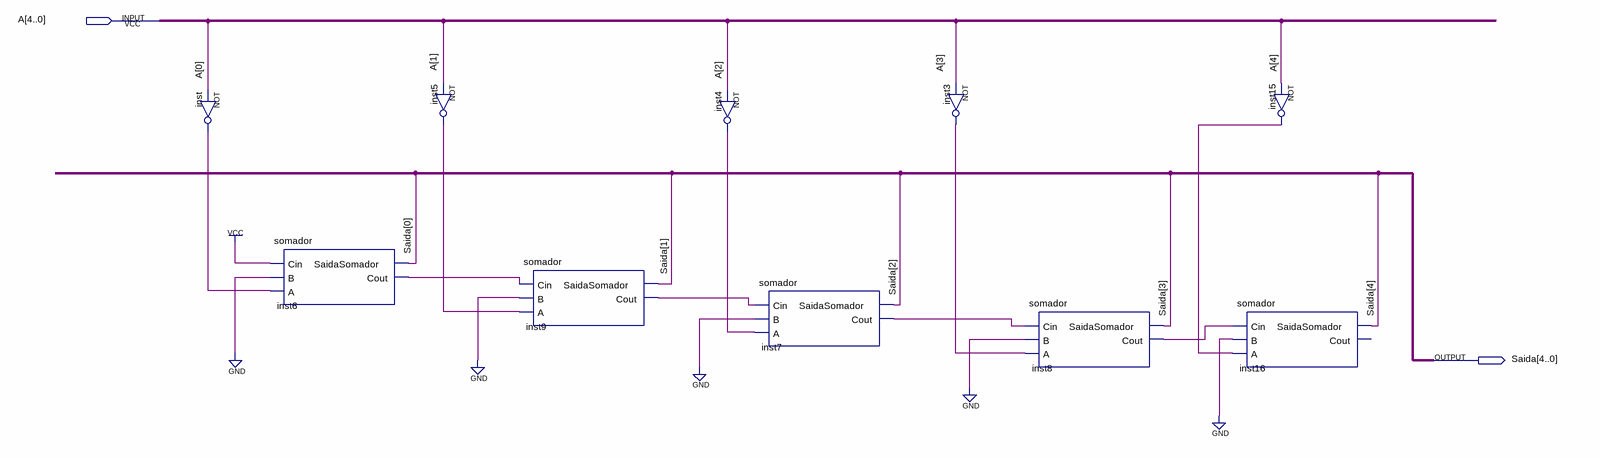
[diagram p0: schematic sheet]
// Quartus schematic Complementa2.bdf as structural Verilog: 10 symbols, 2 pins
module Complementa2 (
  input  [4:0] A,
  output [4:0] Saida
);

  wire inst3_out, inst4_out, inst5_out, inst6_cout, inst7_cout, inst8_cout, inst9_cout, inst15_out, inst_out;

  not inst (inst_out, A[0]);
  somador inst6 (.Cin(1'b1), .B(1'b0), .A(inst_out), .SaidaSomador(Saida[0]), .Cout(inst6_cout));
  not inst5 (inst5_out, A[1]);
  somador inst9 (.Cin(inst6_cout), .B(1'b0), .A(inst5_out), .SaidaSomador(Saida[1]), .Cout(inst9_cout));
  not inst4 (inst4_out, A[2]);
  somador inst7 (.Cin(inst9_cout), .B(1'b0), .A(inst4_out), .SaidaSomador(Saida[2]), .Cout(inst7_cout));
  not inst3 (inst3_out, A[3]);
  somador inst8 (.Cin(inst7_cout), .B(1'b0), .A(inst3_out), .SaidaSomador(Saida[3]), .Cout(inst8_cout));
  somador inst16 (.Cin(inst8_cout), .B(1'b0), .A(inst15_out), .SaidaSomador(Saida[4]));  // open: Cout
  not inst15 (inst15_out, A[4]);
endmodule
